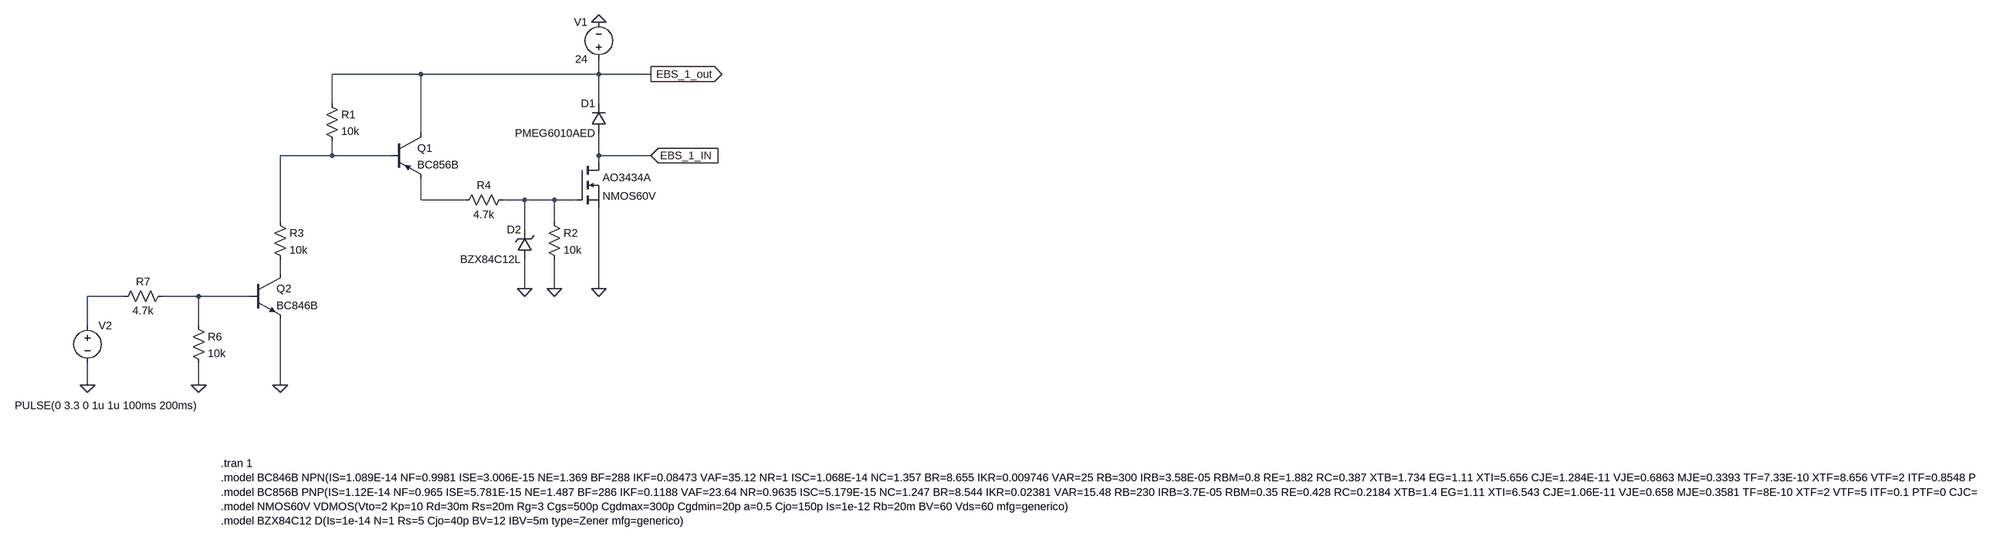
[diagram p0: schematic Draft1.asc]
Draft1.asc, the LTspice schematic file:
Version 4
SHEET 1 4764 1112
WIRE 96 112 -96 112
WIRE 480 112 480 80
WIRE 480 112 96 112
WIRE 592 112 480 112
WIRE -96 176 -96 112
WIRE 480 176 480 112
WIRE 96 240 96 112
WIRE -96 288 -96 256
WIRE -96 288 -208 288
WIRE 32 288 -96 288
WIRE 480 288 480 240
WIRE 592 288 480 288
WIRE 480 304 480 288
WIRE 96 384 96 336
WIRE 192 384 96 384
WIRE 320 384 272 384
WIRE 384 384 320 384
WIRE 432 384 384 384
WIRE -208 432 -208 288
WIRE 384 432 384 384
WIRE 320 448 320 384
WIRE -208 544 -208 512
WIRE 320 576 320 512
WIRE 384 576 384 512
WIRE 480 576 480 400
WIRE -544 592 -624 592
WIRE -384 592 -464 592
WIRE -272 592 -384 592
WIRE -624 656 -624 592
WIRE -384 656 -384 592
WIRE -624 784 -624 736
WIRE -384 784 -384 736
WIRE -208 784 -208 640
FLAG 480 576 0
FLAG 480 0 0
FLAG 592 112 EBS_1_out
IOPIN 592 112 Out
FLAG 592 288 EBS_1_IN
IOPIN 592 288 In
FLAG -624 784 0
FLAG -384 784 0
FLAG -208 784 0
FLAG 384 576 0
FLAG 320 576 0
SYMBOL nmos 432 304 R0
SYMATTR InstName AO3434A
SYMATTR Value NMOS60V
SYMBOL diode 496 240 R180
WINDOW 0 24 64 Left 2
WINDOW 3 24 0 Left 2
SYMATTR InstName D1
SYMATTR Value PMEG6010AED
SYMBOL voltage 480 96 R180
WINDOW 0 24 96 Left 2
WINDOW 3 24 16 Left 2
SYMATTR InstName V1
SYMATTR Value 24
SYMBOL voltage -624 640 R0
WINDOW 3 -157 188 Left 2
SYMATTR InstName V2
SYMATTR Value PULSE(0 3.3 0 1u 1u 100ms 200ms)
SYMBOL res 368 416 R0
SYMATTR InstName R2
SYMATTR Value 10k
SYMBOL Res 288 368 R90
WINDOW 0 0 56 VBottom 2
WINDOW 3 32 56 VTop 2
SYMATTR InstName R4
SYMATTR Value 4.7k
SYMBOL pnp 32 240 R0
SYMATTR InstName Q1
SYMATTR Value BC856B
SYMBOL res -112 160 R0
SYMATTR InstName R1
SYMATTR Value 10k
SYMBOL res -224 416 R0
SYMATTR InstName R3
SYMATTR Value 10k
SYMBOL npn -272 544 R0
SYMATTR InstName Q2
SYMATTR Value BC846B
SYMBOL res -400 640 R0
SYMATTR InstName R6
SYMATTR Value 10k
SYMBOL Res -448 576 R90
WINDOW 0 0 56 VBottom 2
WINDOW 3 32 56 VTop 2
SYMATTR InstName R7
SYMATTR Value 4.7k
SYMBOL zener 336 512 R180
WINDOW 0 24 64 Left 2
WINDOW 3 24 0 Left 2
SYMATTR InstName D2
SYMATTR Value BZX84C12L
TEXT -336 1008 Left 2 !.tran 1\n.model BC846B NPN(IS=1.089E-14 NF=0.9981 ISE=3.006E-15 NE=1.369 BF=288 IKF=0.08473 VAF=35.12 NR=1 ISC=1.068E-14 NC=1.357 BR=8.655 IKR=0.009746 VAR=25 RB=300 IRB=3.58E-05 RBM=0.8 RE=1.882 RC=0.387 XTB=1.734 EG=1.11 XTI=5.656 CJE=1.284E-11 VJE=0.6863 MJE=0.3393 TF=7.33E-10 XTF=8.656 VTF=2 ITF=0.8548 PTF=0 CJC=3.458E-12 VJC=0.5671 MJC=0.3547 XCJC=1 TR=1.2E-06 FC=0.9552 Vceo=65 Icrating=100m mfg=Nexperia)\n.model BC856B PNP(IS=1.12E-14 NF=0.965 ISE=5.781E-15 NE=1.487 BF=286 IKF=0.1188 VAF=23.64 NR=0.9635 ISC=5.179E-15 NC=1.247 BR=8.544 IKR=0.02381 VAR=15.48 RB=230 IRB=3.7E-05 RBM=0.35 RE=0.428 RC=0.2184 XTB=1.4 EG=1.11 XTI=6.543 CJE=1.06E-11 VJE=0.658 MJE=0.3581 TF=8E-10 XTF=2 VTF=5 ITF=0.1 PTF=0 CJC=6.397E-12 VJC=0.5547 MJC=0.39 XCJC=1 TR=1.2E-07 FC=0.7148 Vceo=65 Icrating=100m mfg=Nexperia)\n.model NMOS60V VDMOS(Vto=2 Kp=10 Rd=30m Rs=20m Rg=3 Cgs=500p Cgdmax=300p Cgdmin=20p a=0.5 Cjo=150p Is=1e-12 Rb=20m BV=60 Vds=60 mfg=generico)\n.model BZX84C12 D(Is=1e-14 N=1 Rs=5 Cjo=40p BV=12 IBV=5m type=Zener mfg=generico)

The netlist it stands for:
* Draft1.asc
M§AO3434A EBS_1_IN N003 0 0 NMOS60V
D1 EBS_1_IN EBS_1_out PMEG6010AED
V1 EBS_1_out 0 24
V2 N005 0 PULSE(0 3.3 0 1u 1u 100ms 200ms)
R2 N003 0 10k
R4 N003 N002 4.7k
Q1 EBS_1_out N001 N002 0 BC856B
R1 EBS_1_out N001 10k
R3 N001 N004 10k
Q2 N004 N006 0 0 BC846B
R6 N006 0 10k
R7 N006 N005 4.7k
D2 0 N003 BZX84C12L
.model D D
.lib standard.dio
.model NPN NPN
.model PNP PNP
.lib standard.bjt
.model NMOS NMOS
.model PMOS PMOS
.lib standard.mos
.tran 1
.model BC846B NPN(IS=1.089E-14 NF=0.9981 ISE=3.006E-15 NE=1.369 BF=288 IKF=0.08473 VAF=35.12 NR=1 ISC=1.068E-14 NC=1.357 BR=8.655 IKR=0.009746 VAR=25 RB=300 IRB=3.58E-05 RBM=0.8 RE=1.882 RC=0.387 XTB=1.734 EG=1.11 XTI=5.656 CJE=1.284E-11 VJE=0.6863 MJE=0.3393 TF=7.33E-10 XTF=8.656 VTF=2 ITF=0.8548 PTF=0 CJC=3.458E-12 VJC=0.5671 MJC=0.3547 XCJC=1 TR=1.2E-06 FC=0.9552 Vceo=65 Icrating=100m mfg=Nexperia)
.model BC856B PNP(IS=1.12E-14 NF=0.965 ISE=5.781E-15 NE=1.487 BF=286 IKF=0.1188 VAF=23.64 NR=0.9635 ISC=5.179E-15 NC=1.247 BR=8.544 IKR=0.02381 VAR=15.48 RB=230 IRB=3.7E-05 RBM=0.35 RE=0.428 RC=0.2184 XTB=1.4 EG=1.11 XTI=6.543 CJE=1.06E-11 VJE=0.658 MJE=0.3581 TF=8E-10 XTF=2 VTF=5 ITF=0.1 PTF=0 CJC=6.397E-12 VJC=0.5547 MJC=0.39 XCJC=1 TR=1.2E-07 FC=0.7148 Vceo=65 Icrating=100m mfg=Nexperia)
.model NMOS60V VDMOS(Vto=2 Kp=10 Rd=30m Rs=20m Rg=3 Cgs=500p Cgdmax=300p Cgdmin=20p a=0.5 Cjo=150p Is=1e-12 Rb=20m BV=60 Vds=60 mfg=generico)
.model BZX84C12 D(Is=1e-14 N=1 Rs=5 Cjo=40p BV=12 IBV=5m type=Zener mfg=generico)
.backanno
.end